# Altium schematic sheet 06 - NVM Memories.SchDoc
size B; CompanyName: Microchip Technology Inc.; Organization: Microchip Technology; Address1: 2355 West Chandler Blvd.; Address2: Chandler, AZ  85224; Address4: USA; SheetNumber: 7; SheetTotal: 15; SheetTitle: NVM Memories; Time: Time
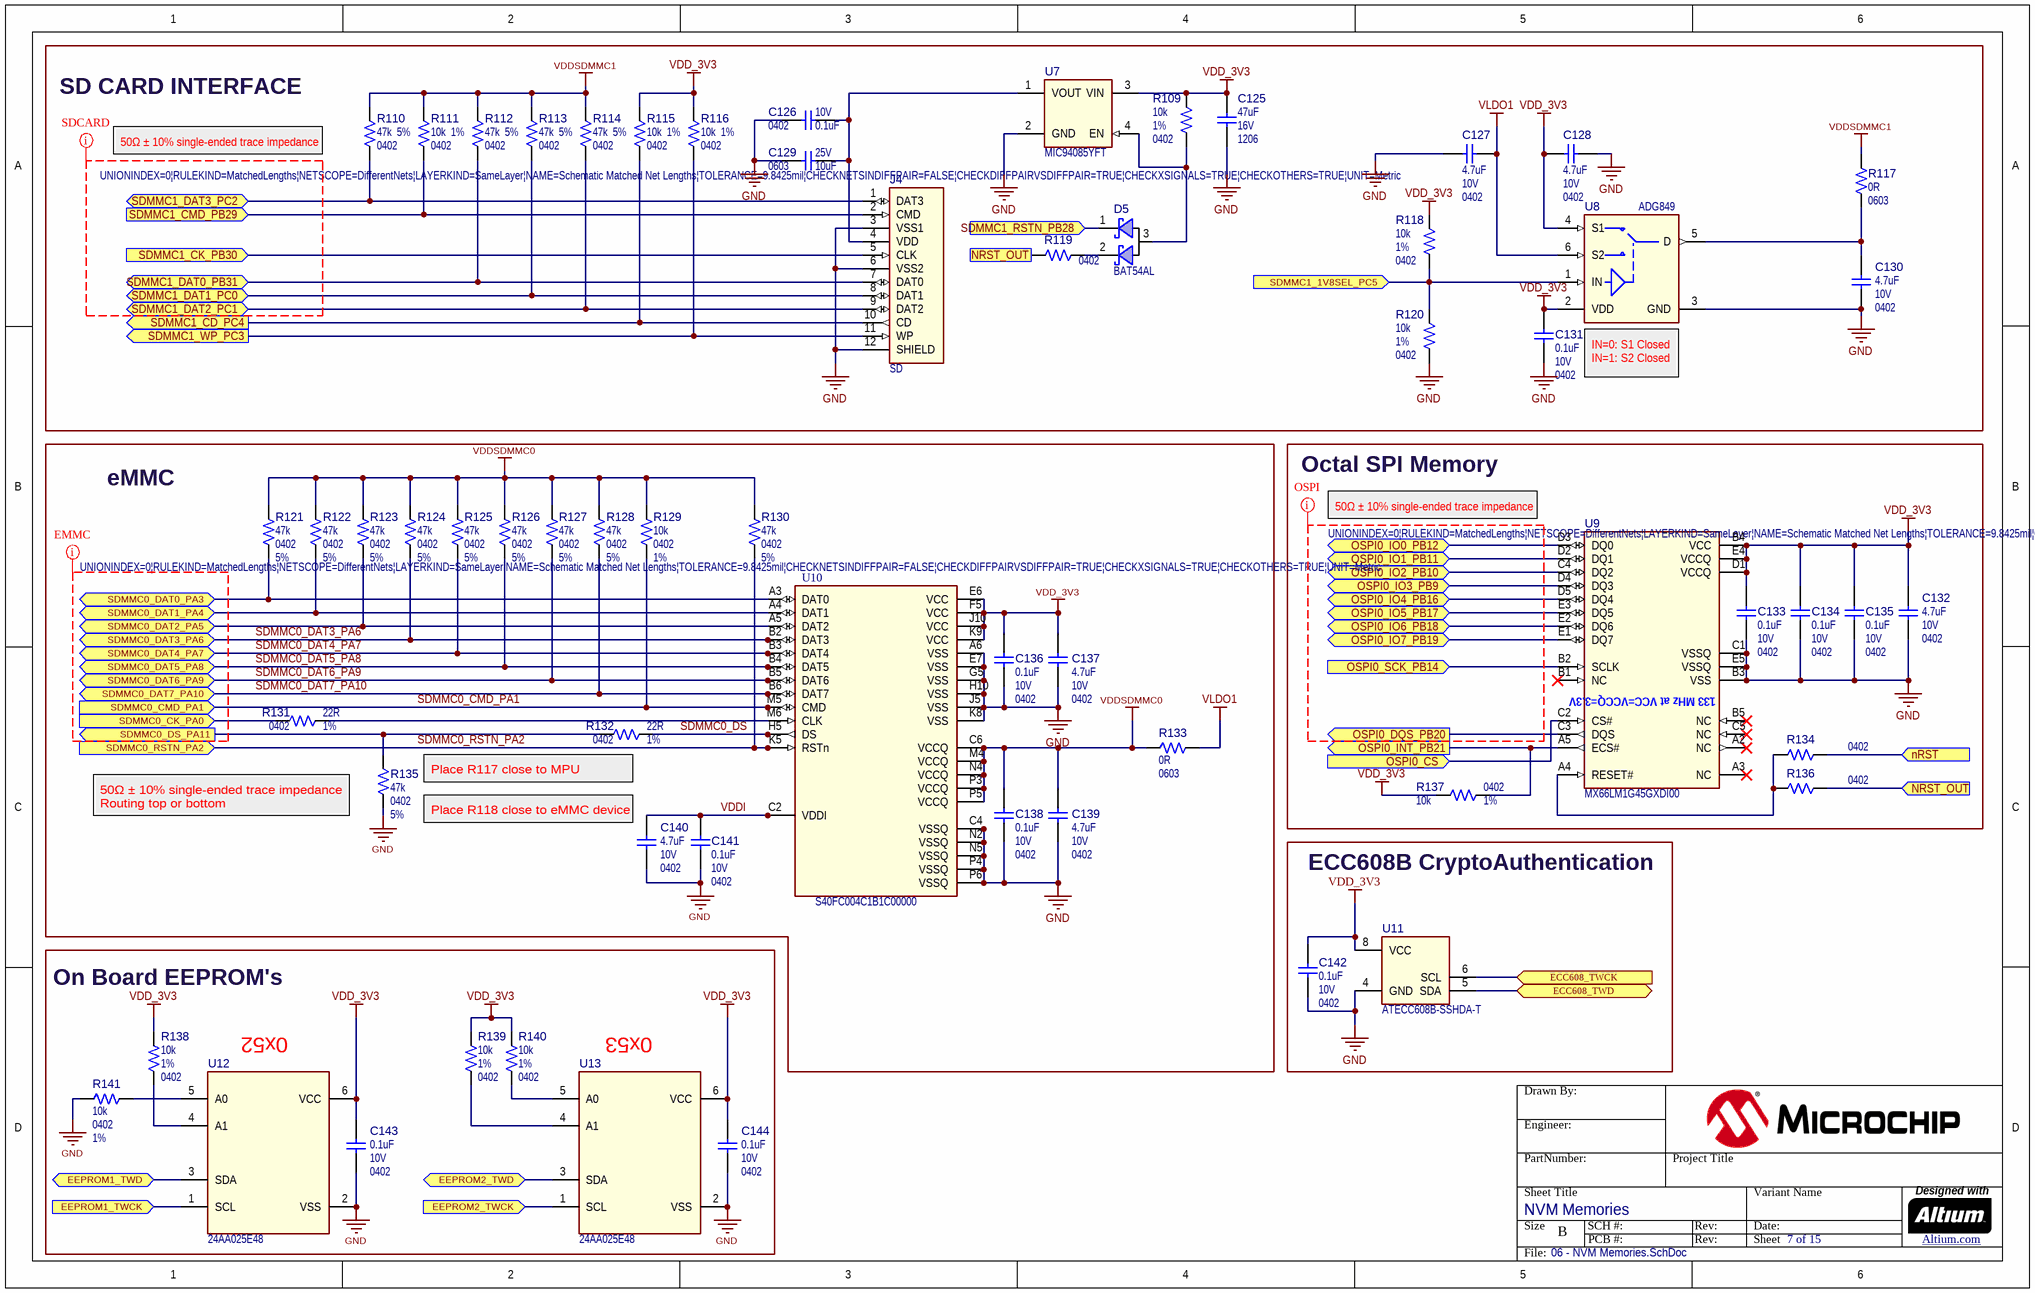
[diagram p0: 06 - NVM Memories.SchDoc]

## Parts
?  (no value)  (graphical)
C125  value 47uF  Voltage: 16V  Package: 1206  [CAP_C_1206]  (hidden comment: Capacitor NP)
C126  value 0.1uF  Voltage: 10V  Package: 0402  [CAP_C_0402]  (hidden comment: Capacitor NP)
C127  value 4.7uF  Voltage: 10V  Package: 0402  [CAP_C_0402]  (hidden comment: Capacitor NP)
C128  value 4.7uF  Voltage: 10V  Package: 0402  [CAP_C_0402]  (hidden comment: Capacitor NP)
C129  value 10uF  Voltage: 25V  Package: 0603  [CAP_C_0603]  (hidden comment: Capacitor NP)
C130  value 4.7uF  Voltage: 10V  Package: 0402  [CAP_C_0402]  (hidden comment: Capacitor NP)
C131  value 0.1uF  Voltage: 10V  Package: 0402  [CAP_C_0402]  (hidden comment: Capacitor NP)
C132  value 4.7uF  Voltage: 10V  Package: 0402  [CAP_C_0402]  (hidden comment: Capacitor NP)
C133  value 0.1uF  Voltage: 10V  Package: 0402  [CAP_C_0402]  (hidden comment: Capacitor NP)
C134  value 0.1uF  Voltage: 10V  Package: 0402  [CAP_C_0402]  (hidden comment: Capacitor NP)
C135  value 0.1uF  Voltage: 10V  Package: 0402  [CAP_C_0402]  (hidden comment: Capacitor NP)
C136  value 0.1uF  Voltage: 10V  Package: 0402  [CAP_C_0402]  (hidden comment: Capacitor NP)
C137  value 4.7uF  Voltage: 10V  Package: 0402  [CAP_C_0402]  (hidden comment: Capacitor NP)
C138  value 0.1uF  Voltage: 10V  Package: 0402  [CAP_C_0402]  (hidden comment: Capacitor NP)
C139  value 4.7uF  Voltage: 10V  Package: 0402  [CAP_C_0402]  (hidden comment: Capacitor NP)
C140  value 4.7uF  Voltage: 10V  Package: 0402  [CAP_C_0402]  (hidden comment: Capacitor NP)
C141  value 0.1uF  Voltage: 10V  Package: 0402  [CAP_C_0402]  (hidden comment: Capacitor NP)
C142  value 0.1uF  Voltage: 10V  Package: 0402  [CAP_C_0402]  (hidden comment: Capacitor NP)
C143  value 0.1uF  Voltage: 10V  Package: 0402  [CAP_C_0402]  (hidden comment: Capacitor NP)
C144  value 0.1uF  Voltage: 10V  Package: 0402  [CAP_C_0402]  (hidden comment: Capacitor NP)
D5  value BAT54AL  [SOT-23-3]  (hidden comment: Diode Schottky Dual CA)
J4  value SD  [10067847-001RLF]  (hidden comment: CON SD CARD 11P_amphenol)
R109  value 10k  Package: 0402  Tolerance: 1%  [RES_C_0402]  (hidden comment: Resistor)
R110  value 47k  Package: 0402  Tolerance: 5%  [RES_C_0402]  (hidden comment: Resistor)
R111  value 10k  Package: 0402  Tolerance: 1%  [RES_C_0402]  (hidden comment: Resistor)
R112  value 47k  Package: 0402  Tolerance: 5%  [RES_C_0402]  (hidden comment: Resistor)
R113  value 47k  Package: 0402  Tolerance: 5%  [RES_C_0402]  (hidden comment: Resistor)
R114  value 47k  Package: 0402  Tolerance: 5%  [RES_C_0402]  (hidden comment: Resistor)
R115  value 10k  Package: 0402  Tolerance: 1%  [RES_C_0402]  (hidden comment: Resistor)
R116  value 10k  Package: 0402  Tolerance: 1%  [RES_C_0402]  (hidden comment: Resistor)
R117  value 0R  Package: 0603  [RES_C_0603]  (hidden comment: Resistor)
R118  value 10k  Package: 0402  Tolerance: 1%  [RES_C_0402]  (hidden comment: Resistor)
R119  Package: 0402  [RES_C_0402]  (hidden comment: Resistor)
R120  value 10k  Package: 0402  Tolerance: 1%  [RES_C_0402]  (hidden comment: Resistor)
R121  value 47k  Package: 0402  Tolerance: 5%  [RES_C_0402]  (hidden comment: Resistor)
R122  value 47k  Package: 0402  Tolerance: 5%  [RES_C_0402]  (hidden comment: Resistor)
R123  value 47k  Package: 0402  Tolerance: 5%  [RES_C_0402]  (hidden comment: Resistor)
R124  value 47k  Package: 0402  Tolerance: 5%  [RES_C_0402]  (hidden comment: Resistor)
R125  value 47k  Package: 0402  Tolerance: 5%  [RES_C_0402]  (hidden comment: Resistor)
R126  value 47k  Package: 0402  Tolerance: 5%  [RES_C_0402]  (hidden comment: Resistor)
R127  value 47k  Package: 0402  Tolerance: 5%  [RES_C_0402]  (hidden comment: Resistor)
R128  value 47k  Package: 0402  Tolerance: 5%  [RES_C_0402]  (hidden comment: Resistor)
R129  value 10k  Package: 0402  Tolerance: 1%  [RES_C_0402]  (hidden comment: Resistor)
R130  value 47k  Package: 0402  Tolerance: 5%  [RES_C_0402]  (hidden comment: Resistor)
R131  value 22R  Package: 0402  Tolerance: 1%  [RES_C_0402]  (hidden comment: Resistor)
R132  value 22R  Package: 0402  Tolerance: 1%  [RES_C_0402]  (hidden comment: Resistor)
R133  value 0R  Package: 0603  [RES_C_0603]  (hidden comment: Resistor)
R134  Package: 0402  [RES_C_0402]  (hidden comment: Resistor)
R135  value 47k  Package: 0402  Tolerance: 5%  [RES_C_0402]  (hidden comment: Resistor)
R136  Package: 0402  [RES_C_0402]  (hidden comment: Resistor)
R137  value 10k  Package: 0402  Tolerance: 1%  [RES_C_0402]  (hidden comment: Resistor)
R138  value 10k  Package: 0402  Tolerance: 1%  [RES_C_0402]  (hidden comment: Resistor)
R139  value 10k  Package: 0402  Tolerance: 1%  [RES_C_0402]  (hidden comment: Resistor)
R140  value 10k  Package: 0402  Tolerance: 1%  [RES_C_0402]  (hidden comment: Resistor)
R141  value 10k  Package: 0402  Tolerance: 1%  [RES_C_0402]  (hidden comment: Resistor)
U7  value MIC94085YFT  [MLF-4 0.85X0.85mm]  (hidden comment: MIC94085YFT MLF-4)
U8  value ADG849  [SC-70-6]  (hidden comment: ADG849 SC70)
U9  MX66LM1G45GXDI00  [BGA-24_6x8]
U10  value S40FC004C1B1C00000  [FBGA-153_11.5x13]  (hidden comment: eMMC MLC NAND flash 200MHz)
U11  value ATECC608B-SSHDA-T  [SOIC-8]  (hidden comment: ATECC508A-SSHxx SOIC-8)
U12  value 24AA025E48  [SOT-23-6]  (hidden comment: 24XXXX SOT-23-6)
U13  value 24AA025E48  [SOT-23-6]  (hidden comment: 24XXXX SOT-23-6)

## Blocks framed on the sheet
SD CARD INTERFACE: C125-C131 D5 J4 R109-R120 U7 U8
eMMC: C136-C141 R121-R133 R135 U10
Octal SPI Memory: C132-C135 R134 R136 R137 U9
ECC608B CryptoAuthentication: C142 U11
On Board EEPROM's: C143 C144 R138-R141 U12 U13

## Ports
ECC608_TWCK (in), ECC608_TWD (bidir), EEPROM1_TWCK (in), EEPROM1_TWD (bidir), EEPROM2_TWCK (in), EEPROM2_TWD (bidir), nRST (in), NRST_OUT (in), OSPI0_CS (in), OSPI0_DQS_PB20 (out), OSPI0_INT_PB21 (out), OSPI0_IO0_PB12 (bidir), OSPI0_IO1_PB11 (bidir), OSPI0_IO2_PB10 (bidir), OSPI0_IO3_PB9 (bidir), OSPI0_IO4_PB16 (bidir), OSPI0_IO5_PB17 (bidir), OSPI0_IO6_PB18 (bidir), OSPI0_IO7_PB19 (bidir), OSPI0_SCK_PB14 (in), SDMMC0_CK_PA0 (in), SDMMC0_CMD_PA1 (in), SDMMC0_DAT0_PA3 (bidir), SDMMC0_DAT1_PA4 (bidir), SDMMC0_DAT2_PA5 (bidir), SDMMC0_DAT3_PA6 (bidir), SDMMC0_DAT4_PA7 (bidir), SDMMC0_DAT5_PA8 (bidir), SDMMC0_DAT6_PA9 (bidir), SDMMC0_DAT7_PA10 (bidir), SDMMC0_DS_PA11 (out), SDMMC0_RSTN_PA2 (in), SDMMC1_1V8SEL_PC5 (in), SDMMC1_CD_PC4 (out), SDMMC1_CK_PB30 (in), SDMMC1_CMD_PB29 (in), SDMMC1_DAT0_PB31 (bidir), SDMMC1_DAT1_PC0 (bidir), SDMMC1_DAT2_PC1 (bidir), SDMMC1_DAT3_PC2 (bidir), SDMMC1_RSTN_PB28 (in), SDMMC1_WP_PC3 (out)

## Nets
GND: C125.2 C126.1 C127.1 C128.2 C129.1 C130.2 C131.1 C132.1 C133.1 C134.1 C135.1 C136.1 C137.1 C138.1 C139.1 C140.1 C141.1 C142.2 C143.1 C144.1 J4.3(VSS1) J4.6(VSS2) J4.12(SHIELD) R120.1 R135.1 R141.2 U7.2(GND) U8.3(GND) U9.B3(VSS) U9.C1(VSSQ) U9.E5(VSSQ) U10.A6(VSS) U10.C4(VSSQ) U10.D4(NC) U10.E7(VSS) U10.G5(VSS) U10.H10(VSS) U10.J5(VSS) U10.K8(VSS) U10.N1(NC) U10.N2(VSSQ) U10.N5(VSSQ) U10.P4(VSSQ) U10.P6(VSSQ) U11.4(GND) U12.2(VSS) U13.2(VSS)
VDD_3V3: C125.1 C128.1 C131.2 C132.2 C133.2 C134.2 C135.2 C136.2 C137.2 C142.1 C143.2 C144.2 R109.2 R115.1 R116.1 R118.2 R137.2 R138.2 R139.2 R140.2 U7.3(VIN) U8.2(VDD) U8.4(S1) U9.B4(VCC) U9.D1(VCCQ) U9.E4(VCCQ) U10.E6(VCC) U10.F5(VCC) U10.J10(VCC) U10.K9(VCC) U11.8(VCC) U12.6(VCC) U13.6(VCC)
VDDSDMMC0: C138.2 C139.2 R121.1 R122.1 R123.1 R124.1 R125.1 R126.1 R127.1 R128.1 R129.2 R130.1 R133.1 U10.C6(VCCQ) U10.M4(VCCQ) U10.N4(VCCQ) U10.P3(VCCQ) U10.P5(VCCQ)
VDDSDMMC1: R110.1 R111.1 R112.1 R113.1 R114.1 R117.1
VLDO1: C127.2 R133.2 U8.6(S2)
ECC608_TWCK: U11.6(SCL) ; port ECC608_TWCK
ECC608_TWD: U11.5(SDA) ; port ECC608_TWD
EEPROM1_TWCK: U12.1(SCL) ; port EEPROM1_TWCK
EEPROM1_TWD: U12.3(SDA) ; port EEPROM1_TWD
EEPROM2_TWCK: U13.1(SCL) ; port EEPROM2_TWCK
EEPROM2_TWD: U13.3(SDA) ; port EEPROM2_TWD
nRST: R134.1 ; port nRST
NRST_OUT: R119.2 R136.1 ; port NRST_OUT
OSPI0_CS: U9.C2(CS#) ; port OSPI0_CS
OSPI0_DQS_PB20: U9.C3(DQS) ; port OSPI0_DQS_PB20
OSPI0_INT_PB21: R137.1 U9.A5(ECS#) ; port OSPI0_INT_PB21
OSPI0_IO0_PB12: U9.D3(DQ0) ; port OSPI0_IO0_PB12
OSPI0_IO1_PB11: U9.D2(DQ1) ; port OSPI0_IO1_PB11
OSPI0_IO2_PB10: U9.C4(DQ2) ; port OSPI0_IO2_PB10
OSPI0_IO3_PB9: U9.D4(DQ3) ; port OSPI0_IO3_PB9
OSPI0_IO4_PB16: U9.D5(DQ4) ; port OSPI0_IO4_PB16
OSPI0_IO5_PB17: U9.E3(DQ5) ; port OSPI0_IO5_PB17
OSPI0_IO6_PB18: U9.E2(DQ6) ; port OSPI0_IO6_PB18
OSPI0_IO7_PB19: U9.E1(DQ7) ; port OSPI0_IO7_PB19
OSPI0_SCK_PB14: U9.B2(SCLK) ; port OSPI0_SCK_PB14
SDMMC0_CK_PA0: R131.1 ; port SDMMC0_CK_PA0
SDMMC0_CMD_PA1: R129.1 U10.L1(NC) U10.L2(NC) U10.L3(NC) U10.M5(CMD) ; port SDMMC0_CMD_PA1
SDMMC0_DAT0_PA3: R121.2 U10.A3(DAT0) ; port SDMMC0_DAT0_PA3
SDMMC0_DAT1_PA4: R122.2 U10.A4(DAT1) ; port SDMMC0_DAT1_PA4
SDMMC0_DAT2_PA5: R123.2 U10.A5(DAT2) ; port SDMMC0_DAT2_PA5
SDMMC0_DAT3_PA6: R124.2 U10.A1(NC) U10.B2(DAT3) ; port SDMMC0_DAT3_PA6
SDMMC0_DAT4_PA7: R125.2 U10.A2(NC) U10.B3(DAT4) ; port SDMMC0_DAT4_PA7
SDMMC0_DAT5_PA8: R126.2 U10.B4(DAT5) U10.C3(NC) U10.D3(NC) U10.E3(NC) ; port SDMMC0_DAT5_PA8
SDMMC0_DAT6_PA9: R127.2 U10.A9(NC) U10.B5(DAT6) U10.B8(NC) U10.C5(NC) U10.C7(NC) ; port SDMMC0_DAT6_PA9
SDMMC0_DAT7_PA10: R128.2 U10.A8(NC) U10.B6(DAT7) U10.B7(NC) ; port SDMMC0_DAT7_PA10
SDMMC0_DS: R132.2 U10.G1(NC) U10.G2(NC) U10.H3(NC) U10.H5(DS)
SDMMC0_DS_PA11: R132.1 R135.2 ; port SDMMC0_DS_PA11
SDMMC0_RSTN_PA2: R130.2 U10.J1(NC) U10.J2(NC) U10.J3(NC) U10.K5(RSTn) ; port SDMMC0_RSTN_PA2
SDMMC1_1V8SEL_PC5: R118.1 R120.2 U8.1(IN) ; port SDMMC1_1V8SEL_PC5
SDMMC1_CD_PC4: J4.10(CD) R115.2 ; port SDMMC1_CD_PC4
SDMMC1_CK_PB30: J4.5(CLK) ; port SDMMC1_CK_PB30
SDMMC1_CMD_PB29: J4.2(CMD) R111.2 ; port SDMMC1_CMD_PB29
SDMMC1_DAT0_PB31: J4.7(DAT0) R112.2 ; port SDMMC1_DAT0_PB31
SDMMC1_DAT1_PC0: J4.8(DAT1) R113.2 ; port SDMMC1_DAT1_PC0
SDMMC1_DAT2_PC1: J4.9(DAT2) R114.2 ; port SDMMC1_DAT2_PC1
SDMMC1_DAT3_PC2: J4.1(DAT3) R110.2 ; port SDMMC1_DAT3_PC2
SDMMC1_RSTN_PB28: D5.1(K) ; port SDMMC1_RSTN_PB28
SDMMC1_WP_PC3: J4.11(WP) R116.2 ; port SDMMC1_WP_PC3
VDDI: C140.2 C141.2 U10.C1(NC) U10.C2(VDDI)
NetC126_2: C126.2 C129.2 J4.4(VDD) U7.1(VOUT)
NetC130_1: C130.1 R117.2 U8.5(D)
NetD5_2: D5.2(K) R119.1
NetD5_3: D5.3(AA) R109.1 U7.4(EN)
NetR131_2: R131.2 U10.M6(CLK)
NetR134_2: R134.2 R136.2 U9.A4(RESET#)
NetR138_1: R138.1 U12.4(A1)
NetR139_1: R139.1 U13.4(A1)
NetR140_1: R140.1 U13.5(A0)
NetR141_1: R141.1 U12.5(A0)

Not connected (* = marked no-connect by the designer): U9 A2(NC)* A3(NC)* B1(NC)* B5(NC)* C5(NC)*

## Layout directives
net class SDCARD; rule Matched Net Lengths [Tolerance = 0.25mm]: (no net found under the mark)
net class OSPI; rule Matched Net Lengths [Tolerance = 0.25mm]: (no net found under the mark)
net class EMMC; rule Matched Net Lengths [Tolerance = 0.25mm]: (no net found under the mark)

## Notes on the sheet
- (near R110) 50Ω ± 10% single-ended trace impedance
- (near U8) IN=0: S1 Closed
  IN=1: S2 Closed
- 50Ω ± 10% single-ended trace impedance
- (near R132) Place R117 close to MPU
- 50Ω ± 10% single-ended trace impedance
  Routing top or bottom
- (near C140) Place R118 close to eMMC device
- (near U12) 0x52
- (near U13) 0x53
- Drawn By:
- Engineer:
- PartNumber:
- Project Title
- Sheet Title
- Size
- B
- SCH #:
- PCB #:
- Rev:
- Variant Name
- Date:
- Sheet
- Designed with
- Altium.com <http://go.altium.com/MicrochipLandingPage_Evaluation.html>
- File:
- (in symbol IC1725) 133 MHz at VCC=VCCQ=3.3V

## Library data of the parts
? = Title Block B
C125 = CAP1331: Capacitor; Manufacturer 1: TDK Corporation; Manufacturer Part Number 1: C3216X5R1C476M160AB; Description_: CAP CER 47uF 16V 20% X5R SMD 1206; Dev Tools Status: Production; Tolerance: 20%; Temperature Coeffcient: X5R; Type: Ceramic; Owner: Bogdan Popescu; Populated: YES; MCHP-ID: CAP1331; Revision: 1; Symbol: Capacitor NP; Status: MCL Design; ComponentLink1URL: https://chn-vm-apps.microchip.com/mchprepo/parts/Datasheets/TDKMLCCCapRange.pdf; ComponentLink1Description: SVN Datasheet; ComponentLink2URL: C:\ALTIUM_WORK\00001_MCHP-CDB\Datasheets\TDKMLCCCapRange.pdf; ComponentLink2Description: Local Datasheet; ComponentLink3URL: C:\ALTIUM_WORK\00001_MCHP-CDB\Library\LibraryRefs\Capacitor NP.SchLib; ComponentLink3Description: Open Symbol; ComponentLink4URL: C:\ALTIUM_WORK\00001_MCHP-CDB\Library\Footprints\CAP_C_1206.PcbLib; ComponentLink4Description: Open Footprint; ComponentLink5Description: Open Footprint 2; ComponentLink6Description: Open Footprint 3; ComponentLink7Description: Open Footprint 4; Operating Temperature: -55C to +85C; Category: Capacitor; Supplier 1: Digi-Key; Supplier Part Number 1: 445-6003-1-ND; Quantity Override: 1
C126 C131 C133-C136 C138 C141-C144 = CAP1238: Capacitor; Manufacturer 1: KEMET; Manufacturer Part Number 1: C0402C104K8RACTU; Description_: CAP CER 0.1uF 10V 10% X7R SMD 0402; Dev Tools Status: Production; Tolerance: 10%; Temperature Coeffcient: X7R; Type: Ceramic; Owner: Tad Ahlvers; Populated: YES; MCHP-ID: CAP1238; Revision: 1; Symbol: Capacitor NP; Status: MCL Design; ComponentLink1URL: https://chn-vm-apps.microchip.com/mchprepo/parts/Datasheets/KEM_C1002_X7R_SMD.pdf; ComponentLink1Description: SVN Datasheet; ComponentLink2URL: C:\ALTIUM_WORK\00001_MCHP-CDB\Datasheets\KEM_C1002_X7R_SMD.pdf; ComponentLink2Description: Local Datasheet; ComponentLink3URL: C:\ALTIUM_WORK\00001_MCHP-CDB\Library\LibraryRefs\Capacitor NP.SchLib; ComponentLink3Description: Open Symbol; ComponentLink4URL: C:\ALTIUM_WORK\00001_MCHP-CDB\Library\Footprints\CAP_C_0402.PcbLib; ComponentLink4Description: Open Footprint; ComponentLink5Description: Open Footprint 2; ComponentLink6Description: Open Footprint 3; ComponentLink7Description: Open Footprint 4; Operating Temperature: -55C to +125C; Category: Capacitor; Manufacturer 2: Samsung; Manufacturer Part Number 2: CL05B104KP5NNNC; Manufacturer 3: Murata Electronics; Manufacturer Part Number 3: GRM155R71A104KA01D; Supplier 1: Digi-Key; Supplier Part Number 1: 399-3520-2-ND; Supplier 2: Digi-Key; Supplier Part Number 2: 1276-1002-2-ND; Supplier 3: Mouser; Supplier Part Number 3: 81-GRM155R71A104KA1D; Quantity Override: 1
C127 C128 = CAP1684: Capacitor; Manufacturer 1: TDK Corporation; Manufacturer Part Number 1: C1005X5R1A475K050BC; Description_: CAP CER 4.7uF 10V 10% X5R SMD 0402; Dev Tools Status: Production; Tolerance: 10%; Temperature Coeffcient: X5R; Type: Ceramic; Owner: Jesus Aviles; Populated: DNP; MCHP-ID: CAP1684; Revision: 1; Symbol: Capacitor NP; Status: MCL Design; ComponentLink1Description: SVN Datasheet; ComponentLink2Description: Local Datasheet; ComponentLink3URL: C:\ALTIUM_WORK\00001_MCHP-CDB\Library\LibraryRefs\Capacitor NP.SchLib; ComponentLink3Description: Open Symbol; ComponentLink4URL: C:\ALTIUM_WORK\00001_MCHP-CDB\Library\Footprints\CAP_C_0402.PcbLib; ComponentLink4Description: Open Footprint; ComponentLink5Description: Open Footprint 2; ComponentLink6Description: Open Footprint 3; ComponentLink7Description: Open Footprint 4; Operating Temperature: -55C to 85C; Category: Capacitor; Supplier 1: Digi-Key; Supplier Part Number 1: 445-13820-1-ND; Quantity Override: 1
C129 = CAP1650: Capacitor; Manufacturer 1: TDK Corporation; Manufacturer Part Number 1: C1608X5R1E106M080AC; Description_: CAP CER 10uF 25V 20% X5R SMD 0603; Dev Tools Status: Production; Tolerance: 20%; Temperature Coeffcient: X5R; Type: Ceramic; Populated: YES; Owner: Razvan Cristescu; MCHP-ID: CAP1650; Revision: 1; Symbol: Capacitor NP; Status: MCL Design; ComponentLink1URL: https://chn-vm-apps.microchip.com/mchprepo/parts/Datasheets/1913358.pdf; ComponentLink1Description: SVN Datasheet; ComponentLink2URL: C:\ALTIUM_WORK\00001_MCHP-CDB\Datasheets\1913358.pdf; ComponentLink2Description: Local Datasheet; ComponentLink3URL: C:\ALTIUM_WORK\00001_MCHP-CDB\Library\LibraryRefs\Capacitor NP.SchLib; ComponentLink3Description: Open Symbol; ComponentLink4URL: C:\ALTIUM_WORK\00001_MCHP-CDB\Library\Footprints\CAP_C_0603.PcbLib; ComponentLink4Description: Open Footprint; ComponentLink5Description: Open Footprint 2; ComponentLink6Description: Open Footprint 3; ComponentLink7Description: Open Footprint 4; Operating Temperature: -55C to +85C; Category: Capacitor; Supplier 1: Farnell; Supplier Part Number 1: 2521968; Quantity Override: 1
C130 C132 C137 C139 C140 = CAP1684: Capacitor; Manufacturer 1: TDK Corporation; Manufacturer Part Number 1: C1005X5R1A475K050BC; Description_: CAP CER 4.7uF 10V 10% X5R SMD 0402; Dev Tools Status: Production; Tolerance: 10%; Temperature Coeffcient: X5R; Type: Ceramic; Owner: Jesus Aviles; Populated: YES; MCHP-ID: CAP1684; Revision: 1; Symbol: Capacitor NP; Status: MCL Design; ComponentLink1Description: SVN Datasheet; ComponentLink2Description: Local Datasheet; ComponentLink3URL: C:\ALTIUM_WORK\00001_MCHP-CDB\Library\LibraryRefs\Capacitor NP.SchLib; ComponentLink3Description: Open Symbol; ComponentLink4URL: C:\ALTIUM_WORK\00001_MCHP-CDB\Library\Footprints\CAP_C_0402.PcbLib; ComponentLink4Description: Open Footprint; ComponentLink5Description: Open Footprint 2; ComponentLink6Description: Open Footprint 3; ComponentLink7Description: Open Footprint 4; Operating Temperature: -55C to 85C; Category: Capacitor; Supplier 1: Digi-Key; Supplier Part Number 1: 445-13820-1-ND; Quantity Override: 1
D5 = DIODE1603: Manufacturer 1: ON Semiconductor; Manufacturer Part Number 1: BAT54ALT1G; Description_: DIO SCTKY ARRAY BAT54AL 800mV 200mA 30V SMD SOT-23-3; Dev Tools Status: Design; Type: Schottky Array; Forward Current: 200mA; Power: 225mW; Reverse Current: 0.5uA; Reverse Recovery Time: 5ns; Reverse Voltage: 30V; Owner: Ciprian Abramov; Populated: YES; MCHP-ID: DIODE1603; Revision: 1; Symbol: Diode Schottky Dual CA; Status: MCL Design; Package: SOT-23-3; ComponentLink1URL: https://chn-vm-apps.microchip.com/mchprepo/parts/Datasheets/BAT54ALT1-D.PDF; ComponentLink1Description: SVN Datasheet; ComponentLink2URL: C:\ALTIUM_WORK\00001_MCHP-CDB\Datasheets\BAT54ALT1-D.PDF; ComponentLink2Description: Local Datasheet; ComponentLink3URL: C:\ALTIUM_WORK\00001_MCHP-CDB\Library\LibraryRefs\Diode Schottky Dual CA.SchLib; ComponentLink3Description: Open Symbol; ComponentLink4URL: C:\ALTIUM_WORK\00001_MCHP-CDB\Library\Footprints\SOT-23-3.PcbLib; ComponentLink4Description: Open Footprint; ComponentLink5Description: Open Footprint 2; ComponentLink6Description: Open Footprint 3; ComponentLink7Description: Open Footprint 4; Operating Temperature: -55C to +150C; Category: Diode; Supplier 1: Digi-Key; Supplier Part Number 1: BAT54ALT1GOSCT-ND; Quantity Override: 1
J4 = CON1752: Manufacturer 1: Amphenol FCI; Description_: 12 (9 + 3) Position Card Connector SD Surface Mount, Right Angle Gold; Dev Tools Status: Design; Owner: Dragos Danaila; Voltage: 17V; Current: 500mA; Populated: YES; MCHP-ID: CON1752; Revision: B; Symbol: CON SD CARD 11P_amphenol; Status: MCL Design; ComponentLink1URL: https://chn-vm-apps.microchip.com/mchprepo/parts/Datasheets/10067847.pdf; ComponentLink1Description: SVN Datasheet; ComponentLink2URL: C:\ALTIUM_WORK\00001_MCHP-CDB\Datasheets\10067847.pdf; ComponentLink2Description: Local Datasheet; ComponentLink3URL: C:\ALTIUM_WORK\00001_MCHP-CDB\Library\LibraryRefs\CON SD CARD 11P_amphenol.SchLib; ComponentLink3Description: Open Symbol; ComponentLink4URL: C:\ALTIUM_WORK\00001_MCHP-CDB\Library\Footprints\10067847-001RLF.PcbLib; ComponentLink4Description: Open Footprint; ComponentLink5Description: Open Footprint 2; ComponentLink6Description: Open Footprint 3; ComponentLink7Description: Open Footprint 4; Type: Flash Card; Category: Connector; Supplier 1: Digi-Key; Supplier Part Number 1: 609-3956-1-ND; Quantity Override: 1
R109 = RSMT1019: Manufacturer 1: Panasonic; Manufacturer Part Number 1: ERJ-2RKF1002X; Description_: RES TKF 10k 1% 1/10W SMD 0402; Dev Tools Status: Production; Voltage: 50V; Temperature Coeffcient: 100ppm/C; Power: 1/10W; Owner: Brent Lanphear; Populated: YES; MCHP-ID: RSMT1019; Revision: 2; Symbol: Resistor; Status: MCL Design; ComponentLink1URL: https://chn-vm-apps.microchip.com/mchprepo/parts/Datasheets/AOA0000CE2.pdf; ComponentLink1Description: SVN Datasheet; ComponentLink2URL: C:\ALTIUM_WORK\00001_MCHP-CDB\Datasheets\AOA0000CE2.pdf; ComponentLink2Description: Local Datasheet; ComponentLink3URL: C:\ALTIUM_WORK\00001_MCHP-CDB\Library\LibraryRefs\Resistor.SchLib; ComponentLink3Description: Open Symbol; ComponentLink4URL: C:\ALTIUM_WORK\00001_MCHP-CDB\Library\Footprints\RES_C_0402.PcbLib; ComponentLink4Description: Open Footprint; ComponentLink5Description: Open Footprint 2; ComponentLink6Description: Open Footprint 3; ComponentLink7Description: Open Footprint 4; Operating Temperature: -55C to +155C; Category: Resistor; Type: RES SMD; Composition: TKF; Supplier 1: Digi-Key; Supplier Part Number 1: P10.0KLCT-ND; Quantity Override: 1
R110 R112-R114 R121-R128 R130 R135 = RES1038: Manufacturer 1: Panasonic; Manufacturer Part Number 1: ERJ-2GEJ473X; Description_: RES TKF 47k 5% 1/10W SMD 0402; Dev Tools Status: Production; Voltage: 50V; Temperature Coeffcient: 200ppm/C; Power: 1/10W; Owner: Tad Ahlvers; Populated: YES; MCHP-ID: RES1038; Revision: 1; Symbol: Resistor; Status: MCL Design; ComponentLink1URL: https://chn-vm-apps.microchip.com/mchprepo/parts/Datasheets/AOA0000CE1.pdf; ComponentLink1Description: SVN Datasheet; ComponentLink2URL: C:\ALTIUM_WORK\00001_MCHP-CDB\Datasheets\AOA0000CE1.pdf; ComponentLink2Description: Local Datasheet; ComponentLink3URL: C:\ALTIUM_WORK\00001_MCHP-CDB\Library\LibraryRefs\Resistor.SchLib; ComponentLink3Description: Open Symbol; ComponentLink4URL: C:\ALTIUM_WORK\00001_MCHP-CDB\Library\Footprints\RES_C_0402.PcbLib; ComponentLink4Description: Open Footprint; ComponentLink5Description: Open Footprint 2; ComponentLink6Description: Open Footprint 3; ComponentLink7Description: Open Footprint 4; Operating Temperature: -55C to +155C; Category: Resistor; Type: RES SMD; Composition: TKF; Supplier 1: Digi-Key; Supplier Part Number 1: P47KJTR-ND; Quantity Override: 1
R111 R115 R116 R120 R129 R137-R141 = RSMT1019: Manufacturer 1: Panasonic; Manufacturer Part Number 1: ERJ-2RKF1002X; Description_: RES TKF 10k 1% 1/10W SMD 0402; Dev Tools Status: Production; Voltage: 50V; Temperature Coeffcient: 100ppm/C; Power: 1/10W; Owner: Brent Lanphear; Populated: Yes; MCHP-ID: RSMT1019; Revision: 2; Symbol: Resistor; Status: MCL Design; ComponentLink1URL: https://chn-vm-apps.microchip.com/mchprepo/parts/Datasheets/AOA0000CE2.pdf; ComponentLink1Description: SVN Datasheet; ComponentLink2URL: C:\ALTIUM_WORK\00001_MCHP-CDB\Datasheets\AOA0000CE2.pdf; ComponentLink2Description: Local Datasheet; ComponentLink3URL: C:\ALTIUM_WORK\00001_MCHP-CDB\Library\LibraryRefs\Resistor.SchLib; ComponentLink3Description: Open Symbol; ComponentLink4URL: C:\ALTIUM_WORK\00001_MCHP-CDB\Library\Footprints\RES_C_0402.PcbLib; ComponentLink4Description: Open Footprint; ComponentLink5Description: Open Footprint 2; ComponentLink6Description: Open Footprint 3; ComponentLink7Description: Open Footprint 4; Operating Temperature: -55C to +155C; Category: Resistor; Type: RES SMD; Composition: TKF; Supplier 1: Digi-Key; Supplier Part Number 1: P10.0KLCT-ND; Quantity Override: 1
R117 R133 = RSMT0001: Manufacturer 1: Panasonic; Manufacturer Part Number 1: ERJ-3GSY0R00V; Description_: RES TKF 0R 1/10W SMD 0603; Dev Tools Status: Production; Power: 1/10W; Populated: Yes; MCHP-ID: RSMT0001; Revision: 2; Symbol: Resistor; Status: MCL Design; ComponentLink1URL: https://chn-vm-apps.microchip.com/mchprepo/parts/Datasheets/nrc.pdf; ComponentLink1Description: SVN Datasheet; ComponentLink2URL: C:\ALTIUM_WORK\00001_MCHP-CDB\Datasheets\nrc.pdf; ComponentLink2Description: Local Datasheet; ComponentLink3URL: C:\ALTIUM_WORK\00001_MCHP-CDB\Library\LibraryRefs\Resistor.SchLib; ComponentLink3Description: Open Symbol; ComponentLink4URL: C:\ALTIUM_WORK\00001_MCHP-CDB\Library\Footprints\RES_C_0603.PcbLib; ComponentLink4Description: Open Footprint; ComponentLink5Description: Open Footprint 2; ComponentLink6Description: Open Footprint 3; ComponentLink7Description: Open Footprint 4; Operating Temperature: -55C to +155C; Category: Resistor; Type: RES SMD; Composition: TKF; Manufacturer 2: Panasonic; Manufacturer Part Number 2: ERJ-3GEY0R00V; Manufacturer 3: ROHM; Manufacturer Part Number 3: MCR03EZPJ000; Manufacturer 4: Stackpole Electronics Inc; Manufacturer Part Number 4: RMCF0603ZT0R00; Manufacturer 5: Stackpole Electronics Inc; Manufacturer Part Number 5: RMCF 1/16 0 R; Manufacturer 6: Vishay; Manufacturer Part Number 6: CRCW06030000Z0EA; Manufacturer 7: Yageo; Manufacturer Part Number 7: RC0603JR-070RL; Manufacturer 8: KOA Speer; Manufacturer Part Number 8: RK73Z1JTTP; Manufacturer 9: NIC Components; Manufacturer Part Number 9: NRC06Z0TRF; Supplier 1: Digi-Key; Supplier Part Number 1: P0.0GTR-ND; Supplier 2: Digi-Key; Supplier Part Number 2: RHM0.0GCT-ND; Supplier 3: Digi-Key; Supplier Part Number 3: RMCF0603ZT0R00TR-ND; Supplier 4: Digi-Key; Supplier Part Number 4: RMCF0603ZT0R00CT-ND; Supplier 5: Digi-Key; Supplier Part Number 5: RMCF1/160RTR-ND; Supplier 6: Digi-Key; Supplier Part Number 6: 541-0.0GCT-ND; Supplier 7: Digi-Key; Supplier Part Number 7: 311-0.0GRCT-ND; Supplier 8: KOA Speer; Supplier Part Number 8: RK73Z1JTTP; Supplier 9: NIC Components; Supplier Part Number 9: NRC06Z0TRF; Quantity Override: 1
R118 = RSMT1019: Manufacturer 1: Panasonic; Manufacturer Part Number 1: ERJ-2RKF1002X; Description_: RES TKF 10k 1% 1/10W SMD 0402; Dev Tools Status: Production; Voltage: 50V; Temperature Coeffcient: 100ppm/C; Power: 1/10W; Owner: Brent Lanphear; Populated: DNP; MCHP-ID: RSMT1019; Revision: 2; Symbol: Resistor; Status: MCL Design; ComponentLink1URL: https://chn-vm-apps.microchip.com/mchprepo/parts/Datasheets/AOA0000CE2.pdf; ComponentLink1Description: SVN Datasheet; ComponentLink2URL: C:\ALTIUM_WORK\00001_MCHP-CDB\Datasheets\AOA0000CE2.pdf; ComponentLink2Description: Local Datasheet; ComponentLink3URL: C:\ALTIUM_WORK\00001_MCHP-CDB\Library\LibraryRefs\Resistor.SchLib; ComponentLink3Description: Open Symbol; ComponentLink4URL: C:\ALTIUM_WORK\00001_MCHP-CDB\Library\Footprints\RES_C_0402.PcbLib; ComponentLink4Description: Open Footprint; ComponentLink5Description: Open Footprint 2; ComponentLink6Description: Open Footprint 3; ComponentLink7Description: Open Footprint 4; Operating Temperature: -55C to +155C; Category: Resistor; Type: RES SMD; Composition: TKF; Supplier 1: Digi-Key; Supplier Part Number 1: P10.0KLCT-ND; Quantity Override: 1
R119 R134 = RES2693: Manufacturer 1: Bourns Inc.; Manufacturer Part Number 1: CR0402-J/-000GLF; Description_: RES TKF 0R 1/16W SMD 0402; Dev Tools Status: Design; Power: 1/16W; Populated: DNP; Owner: Dragos Danaila; Voltage: 50V; Temperature Coeffcient: 100ppm/C; Current: 1A; MCHP-ID: RES2693; Revision: 1; Symbol: Resistor; Status: MCL Design; ComponentLink1URL: https://chn-vm-apps.microchip.com/mchprepo/parts/Datasheets/crxxxxx.pdf; ComponentLink1Description: SVN Datasheet; ComponentLink2URL: C:\ALTIUM_WORK\00001_MCHP-CDB\Datasheets\crxxxxx.pdf; ComponentLink2Description: Local Datasheet; ComponentLink3URL: C:\ALTIUM_WORK\00001_MCHP-CDB\Library\LibraryRefs\Resistor.SchLib; ComponentLink3Description: Open Symbol; ComponentLink4URL: C:\ALTIUM_WORK\00001_MCHP-CDB\Library\Footprints\RES_C_0402.PcbLib; ComponentLink4Description: Open Footprint; ComponentLink5Description: Open Footprint 2; ComponentLink6Description: Open Footprint 3; ComponentLink7Description: Open Footprint 4; Operating Temperature: -55C to +155C; Category: Resistor; Type: RES SMD; Composition: TKF; Supplier 1: Digikey; Supplier Part Number 1: CR0402-J/-000GLFTR-ND; Quantity Override: 1
R131 R132 = RES1474: Manufacturer 1: Panasonic Electronic Components; Manufacturer Part Number 1: ERJ-2RKF22R0X; Description_: RES TKF 22R 1% 1/20W SMD 0402; Dev Tools Status: Production; Temperature Coeffcient: 100ppm/C; Circuit Type: Isolated; Power: 1/10W; Owner: Mike Ragsdale; Populated: YES; MCHP-ID: RES1474; Revision: 1; Symbol: Resistor; Status: MCL Design; ComponentLink1Description: SVN Datasheet; ComponentLink2Description: Local Datasheet; ComponentLink3URL: C:\ALTIUM_WORK\00001_MCHP-CDB\Library\LibraryRefs\Resistor.SchLib; ComponentLink3Description: Open Symbol; ComponentLink4URL: C:\ALTIUM_WORK\00001_MCHP-CDB\Library\Footprints\RES_C_0402.PcbLib; ComponentLink4Description: Open Footprint; ComponentLink5Description: Open Footprint 2; ComponentLink6Description: Open Footprint 3; ComponentLink7Description: Open Footprint 4; Operating Temperature: -55C to +155C; Category: Resistor; Type: RES SMD; Composition: TKF; Supplier 1: Digi-Key; Supplier Part Number 1: P22.0LCT-ND; Quantity Override: 1
R136 = RES2693: Manufacturer 1: Bourns Inc.; Manufacturer Part Number 1: CR0402-J/-000GLF; Description_: RES TKF 0R 1/16W SMD 0402; Dev Tools Status: Design; Power: 1/16W; Populated: YES; Owner: Dragos Danaila; Voltage: 50V; Temperature Coeffcient: 100ppm/C; Current: 1A; MCHP-ID: RES2693; Revision: 1; Symbol: Resistor; Status: MCL Design; ComponentLink1URL: https://chn-vm-apps.microchip.com/mchprepo/parts/Datasheets/crxxxxx.pdf; ComponentLink1Description: SVN Datasheet; ComponentLink2URL: C:\ALTIUM_WORK\00001_MCHP-CDB\Datasheets\crxxxxx.pdf; ComponentLink2Description: Local Datasheet; ComponentLink3URL: C:\ALTIUM_WORK\00001_MCHP-CDB\Library\LibraryRefs\Resistor.SchLib; ComponentLink3Description: Open Symbol; ComponentLink4URL: C:\ALTIUM_WORK\00001_MCHP-CDB\Library\Footprints\RES_C_0402.PcbLib; ComponentLink4Description: Open Footprint; ComponentLink5Description: Open Footprint 2; ComponentLink6Description: Open Footprint 3; ComponentLink7Description: Open Footprint 4; Operating Temperature: -55C to +155C; Category: Resistor; Type: RES SMD; Composition: TKF; Supplier 1: Digikey; Supplier Part Number 1: CR0402-J/-000GLFTR-ND; Quantity Override: 1
U7 = MIC8847: Manufacturer 1: Microchip Technology; Manufacturer Part Number 1: MIC94085YFT-TR; Description_: MCHP ANALOG POWER SWITCH 1.7V to 5.5V 2A MIC94085YFT 4-TMLF; Dev Tools Status: Design; Owner: Ciprian Abramov; Populated: YES; MCHP-ID: MIC8847; Symbol: MIC94085YFT MLF-4; Type: Power Switch; Status: MCL Design; Revision: 1; Category: MCHP-Analog; ComponentLink1Description: SVN Datasheet; ComponentLink2Description: Local Datasheet; ComponentLink3URL: C:\ALTIUM_WORK\00001_MCHP-CDB\Library\LibraryRefs\MIC94085YFT MLF-4.SchLib; ComponentLink3Description: Open Symbol; ComponentLink4URL: C:\ALTIUM_WORK\00001_MCHP-CDB\Library\Footprints\MLF-4 0.85X0.85mm.PcbLib; ComponentLink4Description: Open Footprint; ComponentLink5Description: Open Footprint 2; ComponentLink6Description: Open Footprint 3; ComponentLink7Description: Open Footprint 4; Supplier 1: Digi-Key; Supplier Part Number 1: 576-3345-1-ND; Quantity Override: 1
U8 = IC1435: IC SWITCHER ADG849 Analog Switch SC70; Manufacturer 1: Analog Devices Inc.; Manufacturer Part Number 1: ADG849YKSZ-REEL7; MCHP-ID: IC1435; Dev Tools Status: Production; Vin: 5V; Owner: Dragos Danaila; Populated: YES; Revision: 1; Symbol: ADG849 SC70; Description_: IC SWITCHER ADG849 Analog Switch SC70; Status: MCL Design; Package: SC-70-6; ComponentLink1URL: https://chn-vm-apps.microchip.com/mchprepo/parts/Datasheets/ADG849.pdf; ComponentLink1Description: SVN Datasheet; ComponentLink2URL: C:\ALTIUM_WORK\00001_MCHP-CDB\Datasheets\ADG849.pdf; ComponentLink2Description: Local Datasheet; ComponentLink3URL: C:\ALTIUM_WORK\00001_MCHP-CDB\Library\LibraryRefs\ADG849 SC70.SchLib; ComponentLink3Description: Open Symbol; ComponentLink4URL: C:\ALTIUM_WORK\00001_MCHP-CDB\Library\Footprints\SC-70-6.PcbLib; ComponentLink4Description: Open Footprint; ComponentLink5Description: Open Footprint 2; ComponentLink6Description: Open Footprint 3; ComponentLink7Description: Open Footprint 4; Operating Temperature: -40C to +125C; Type: Switcher; Category: IC; Supplier 1: Digi-Key; Supplier Part Number 1: ADG849YKSZ-REEL7CT-ND; Quantity Override: 1
U9 = IC1725: FLASH Memory 133MHz; Manufacturer 1: Macronix; MCHP-ID: IC1725; Description_: IC MEMORY MX66LM1G45GXDI00 1Gb PARALLEL FBGA-24; Dev Tools Status: Design; Vin: 2.7V to 3.6V; Owner: Ciprian Abramov; Populated: YES; Value: MX66LM1G45GXDI00; Revision: 1; Symbol: MX66LM1G45GXDI00 FBGA-24; Status: MCL Design; Package: FBGA-24; ComponentLink1URL: https://chn-vm-apps.microchip.com/mchprepo/parts/Datasheets/MX66LM1G45G,%203V,%201Gb,%20v1.0.pdf; ComponentLink1Description: SVN Datasheet; ComponentLink2URL: C:\ALTIUM_WORK\00001_MCHP-CDB\Datasheets\MX66LM1G45G,%203V,%201Gb,%20v1.0.pdf; ComponentLink2Description: Local Datasheet; ComponentLink3URL: C:\ALTIUM_WORK\00001_MCHP-CDB\Library\LibraryRefs\MX66LM1G45GXDI00 FBGA-24.SchLib; ComponentLink3Description: Open Symbol; ComponentLink4URL: C:\ALTIUM_WORK\00001_MCHP-CDB\Library\Footprints\BGA-24_6x8.PcbLib; ComponentLink4Description: Open Footprint; ComponentLink5Description: Open Footprint 2; ComponentLink6Description: Open Footprint 3; ComponentLink7Description: Open Footprint 4; Operating Temperature: -40C to +85C; Type: Memory; Category: IC; Manufacturer Part Number 1: MX66LM1G45GXDI00; Supplier 1: Digi-Key; Supplier Part Number 1: 1092-1257-ND; Quantity Override: 1
U10 = IC2000: Manufacturer 1: SkyHigh Memory; MCHP-ID: IC2000; Description_: IC MEMORY S40FC004C1B1C00000 32Gb eMMC FBGA-153; Dev Tools Status: Production; Vin: 3.3V; Owner: Ciprian Abramov; Populated: YES; Revision: 1; Symbol: S40FC004C1B1C00000 FBGA-153; Status: MCL Design; Package: VFBGA-153; ComponentLink1URL: https://chn-vm-apps.microchip.com/mchprepo/parts/Datasheets/SkyHigh_Memory_4GB_153_ball_VFBGA_eMMC_5.1_Data_Sh-1812167.pdf; ComponentLink1Description: SVN Datasheet; ComponentLink2URL: C:\ALTIUM_WORK\00001_MCHP-CDB\Datasheets\SkyHigh_Memory_4GB_153_ball_VFBGA_eMMC_5.1_Data_Sh-1812167.pdf; ComponentLink2Description: Local Datasheet; ComponentLink3URL: C:\ALTIUM_WORK\00001_MCHP-CDB\Library\LibraryRefs\S40FC004C1B1C00000 FBGA-153.SchLib; ComponentLink3Description: Open Symbol; ComponentLink4URL: C:\ALTIUM_WORK\00001_MCHP-CDB\Library\Footprints\FBGA-153_11.5x13.PcbLib; ComponentLink4Description: Open Footprint; ComponentLink5Description: Open Footprint 2; ComponentLink6Description: Open Footprint 3; ComponentLink7Description: Open Footprint 4; Operating Temperature: -25C to +85C; Type: Memory; Category: IC; Manufacturer Part Number 1: S40FC004C1B1C00000; Supplier 1: Mouser; Supplier Part Number 1: 727-S40FC004C1B1C000; Quantity Override: 1
U11 = MIC9353: Manufacturer 1: Microchip Technology; Description_: MCHP MEMORY SERIAL EEPROM CRYPTO I2C ATECC608B-SSHDA-T SOIC-8; Dev Tools Status: Design; Owner: Jose Luis Caceres; Populated: YES; MCHP-ID: MIC9353; Symbol: ATECC508A-SSHxx SOIC-8; Status: MCL Design; Revision: 1; Category: MCHP-Memory; ComponentLink1Description: SVN Datasheet; ComponentLink2Description: Local Datasheet; ComponentLink3URL: C:\ALTIUM_WORK\00001_MCHP-CDB\Library\LibraryRefs\ATECC508A-SSHxx SOIC-8.SchLib; ComponentLink3Description: Open Symbol; ComponentLink4URL: C:\ALTIUM_WORK\00001_MCHP-CDB\Library\Footprints\SOIC-8.PcbLib; ComponentLink4Description: Open Footprint; ComponentLink5Description: Open Footprint 2; ComponentLink6Description: Open Footprint 3; ComponentLink7Description: Open Footprint 4; Manufacturer Part Number 1: ATECC608B-SSHDA-T; Supplier 1: Microchip Technology; Supplier Part Number 1: ATECC608B-SSHDA-T; Quantity Override: 1; Type: Serial EEPROM; ComponentLink1URL: https://chn-vm-apps.microchip.com/mchprepo/parts/Datasheets/ATECC608B-CryptoAuthentication-Device-Summary-Data-Sheet-DS40002239A.pdf; ComponentLink2URL: C:\ALTIUM_WORK\00001_MCHP-CDB\Datasheets\ATECC608B-CryptoAuthentication-Device-Summary-Data-Sheet-DS40002239A.pdf; Operating Temperature: -40C to +85C
U12 U13 = MIC7407: Manufacturer 1: Microchip Technology; Manufacturer Part Number 1: 24AA025E48T-I/OT; Description_: MCHP MEMORY SERIAL EEPROM 2Kb I2C 24AA025E48T-I/OT SOT-23-6; MAPS Description: 24AA025E48 device, which will be a pre-prog. version of the 24AA024H (DFAX7).; Dev Tools Status: Design; Owner: Ciprian Abramov; MPC: DFAX7TC8XD00; PackingMedia: T/R; TempRange: -40C to +85C; Stage: REL; LeadCount: 6; ForceMinOrderQtyMult: True; MinOrderQty: 0; LeadContent: Pb-FREE; MemorySize: 2K; OpVoltMin: 1.7; OpVoltMax: 5.5; MaxClockFreq: 400 kHz; AddressPins: 3; PageSize_B: 16; WPScheme: Half Array; MemoryOrg: x8; Endurance: 1,000,000; Comments: memory size changed from 2KBits to 2K; Populated: YES; MCHP-ID: MIC7407; Symbol: 24XXXX SOT-23-6; Type: Serial EEPROM; Status: MCL Design; Revision: A; Category: MCHP-Memory; ComponentLink1URL: http://www.microchip.com/wwwproducts/24AA025E48; ComponentLink1Description: SVN Datasheet; ComponentLink2Description: Local Datasheet; ComponentLink3URL: C:\ALTIUM_WORK\00001_MCHP-CDB\Library\LibraryRefs\24XXXX SOT-23-6.SchLib; ComponentLink3Description: Open Symbol; ComponentLink4URL: C:\ALTIUM_WORK\00001_MCHP-CDB\Library\Footprints\SOT-23-6.PcbLib; ComponentLink4Description: Open Footprint; ComponentLink5Description: Open Footprint 2; ComponentLink6Description: Open Footprint 3; ComponentLink7Description: Open Footprint 4; Supplier 1: Digi-Key; Supplier Part Number 1: 24AA025E48T-I/OTCT-ND; PackageType: SOT-23; IntroductionDate: 2010-06-10; Quantity Override: 1